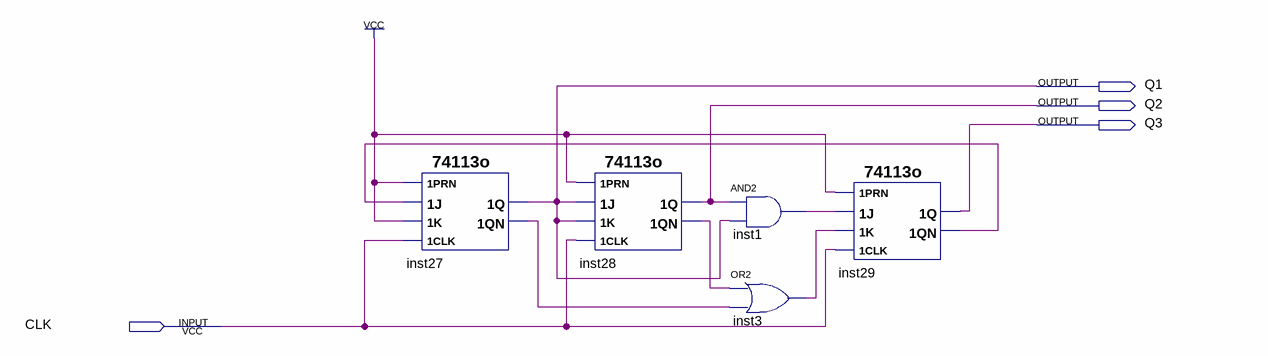
[diagram p0: schematic sheet]
// Quartus schematic 5counter.bdf as structural Verilog: 5 symbols, 4 pins
module \5counter  (
  input  CLK,
  output Q1,
  output Q2,
  output Q3
);

  wire inst1_out, inst3_out, inst27_1qn, inst28_1qn, inst29_1qn;

  \74113o  inst27 (.\1K (1'b1), .\1J (inst29_1qn), .\1CLK (CLK), .\1PRN (1'b1), .\1QN (inst27_1qn), .\1Q (Q1));
  \74113o  inst28 (.\1K (Q1), .\1J (Q1), .\1CLK (CLK), .\1PRN (1'b1), .\1QN (inst28_1qn), .\1Q (Q2));
  and inst1 (inst1_out, Q2, Q1);
  or inst3 (inst3_out, inst28_1qn, inst27_1qn);
  \74113o  inst29 (.\1K (inst3_out), .\1J (inst1_out), .\1CLK (CLK), .\1PRN (1'b1), .\1QN (inst29_1qn), .\1Q (Q3));
endmodule
